# Altium schematic sheet Ref_DAC.SchDoc
size OrCAD A
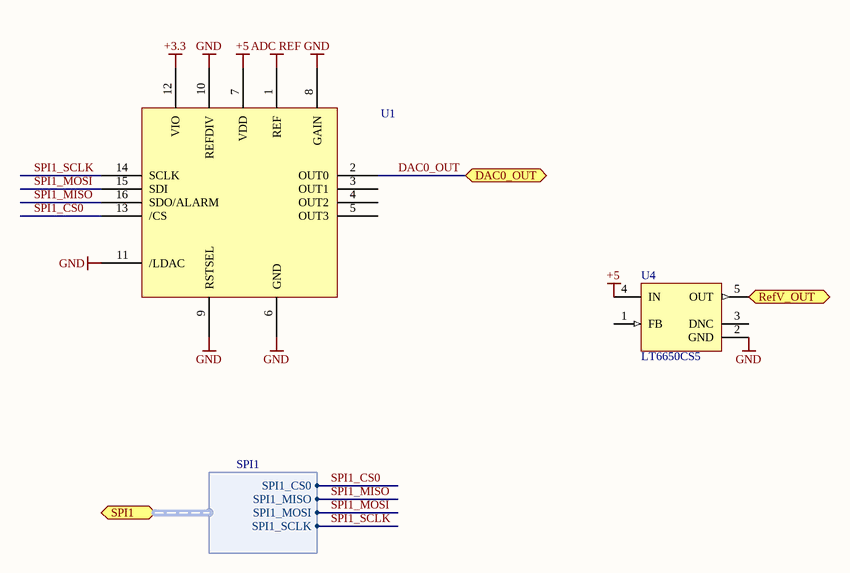
[diagram p0: Ref_DAC.SchDoc]

## Parts
U1  DAC80504  [DAC80504]  (value not drawn)
U4  LT6650CS5  [LT-S5-5-TSOT-23_L]

## Ports
DAC0_OUT, RefV_OUT, SPI1 (harness SPI1)

## Harnesses
SPI1: SPI1_CS0, SPI1_MISO, SPI1_MOSI, SPI1_SCLK

## Nets
+3.3: U1.12(VIO)
+5: U1.7(VDD) U4.4(IN)
ADC REF: U1.1(REF)
GND: U1.6(GND) U1.8(GAIN) U1.9(RSTSEL) U1.10(REFDIV) U1.11(/LDAC) U4.2(GND)
DAC0_OUT: U1.2(OUT0) ; port DAC0_OUT
RefV_OUT: U4.5(OUT) ; port RefV_OUT
SPI1_CS0: U1.13(/CS) ; port SPI1.SPI1_CS0
SPI1_MISO: U1.16(SDO/ALARM) ; port SPI1.SPI1_MISO
SPI1_MOSI: U1.15(SDI) ; port SPI1.SPI1_MOSI
SPI1_SCLK: U1.14(SCLK) ; port SPI1.SPI1_SCLK

Not connected (* = marked no-connect by the designer): U1 3(OUT1) 4(OUT2) 5(OUT3); U4 1(FB) 3(DNC)

## Notes on the sheet
- Title
- Size:
- Date:
- Orcad A
- Number:
- Time:
- Revision:
- Sheet
- of
- ZLS Corporation
- 7801 North Lamar Blvd.
- Suite E-184
- Austin, Texas 78752  USA
- (512) 453-0288
- File:

## Library data of the parts
U4 = CMP-1567-00009-1: Micropower, 400 mV Reference with Rail-to-Rail Buffer Amplifier, 1.4 to 18 V, 0 to 70 degC, 5-Pin SOT-23 (S5); VIN Min: 1.4 V; VIN Max: 18 V; PackageVersion: Rev. B, 06/2010; Code_JEDEC: MO-193; ComponentLink3Description: Package Specification; ComponentLink3URL: http://cds.linear.com/docs/en/packaging/SOT_5_05-08-1635.pdf; ComponentLink2Description: Datasheet; PartNumber: LT6650CS5; Temperature Max: 70 degC; ComponentLink1URL: http://www.linear.com/; Temperature Min: 0 degC; PackageDescription: 5-Pin Plastic Thin Small Out-Line Transistor, Body 1.63 x 2.90 mm, Pitch 0.95 mm; ComponentLink2URL: http://cds.linear.com/docs/en/datasheet/6650fa.pdf; Mounting Technology: Surface Mount; ComponentLink1Description: Manufacturer URL